# Altium project Grandmaster.PrjPcb
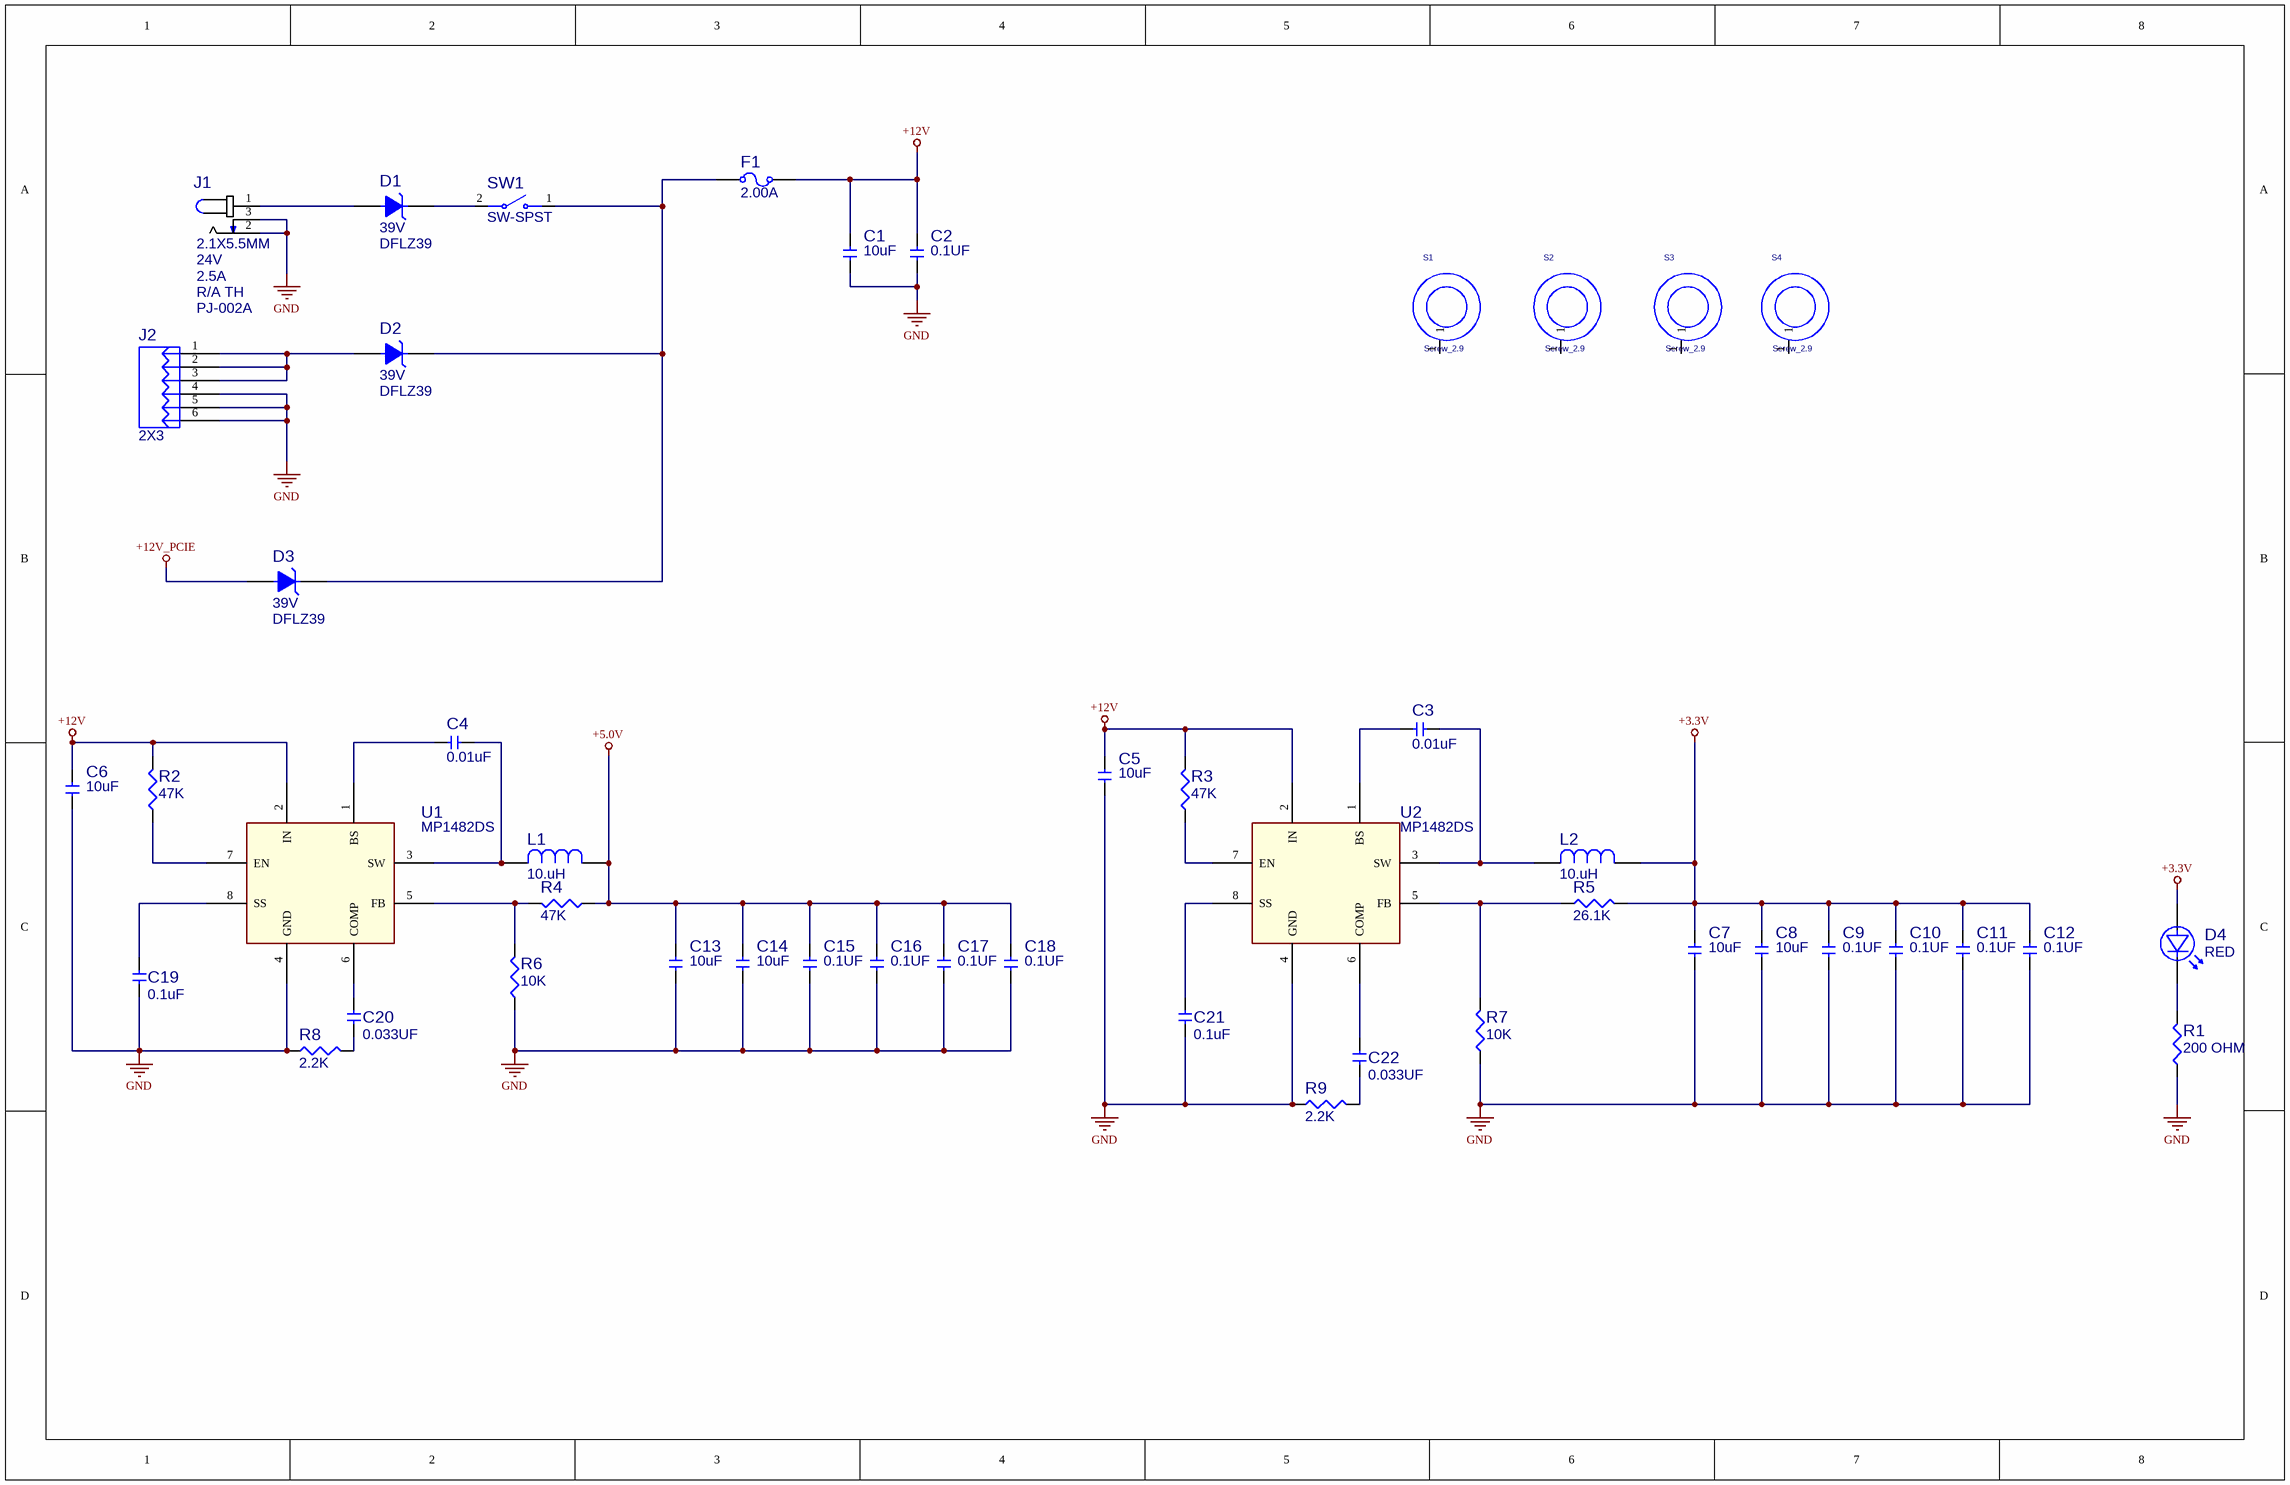
[diagram p0: Power Supplies.SchDoc]
3 sheets, 76 parts. Net scope: global (net labels, ports and power ports of the same name join across sheets).
Board file: Grandmaster.PcbDoc
Sheets:
  Power Supplies.SchDoc
  GPS-IMU.SchDoc
  FPGA.SchDoc

## Sheet Power Supplies.SchDoc: Grandmaster Power Supplies
size Tabloid; Author: N Smith; Revision: A; SheetNumber: 1; SheetTotal: 6; Customer: 01910

### Parts
C1  value 10uF  [CAPC2012X14N]  (hidden comment: CAP_0805_10UF_25V)
C2  value 0.1UF  [CAPC1005X06N]  (hidden comment: CAP_0402_0.1UF_50V)
C3  value 0.01uF  [CAPC1608X10N]  (hidden comment: CAP_0603_0.01UF_50V)
C4  value 0.01uF  [CAPC1608X10N]  (hidden comment: CAP_0603_0.01UF_50V)
C5  value 10uF  [CAPC2012X14N]  (hidden comment: CAP_0805_10UF_25V)
C6  value 10uF  [CAPC2012X14N]  (hidden comment: CAP_0805_10UF_25V)
C7  value 10uF  [CAPC2012X14N]  (hidden comment: CAP_0805_10UF_25V)
C8  value 10uF  [CAPC2012X14N]  (hidden comment: CAP_0805_10UF_25V)
C9  value 0.1UF  [CAPC1005X06N]  (hidden comment: CAP_0402_0.1UF_50V)
C10  value 0.1UF  [CAPC1005X06N]  (hidden comment: CAP_0402_0.1UF_50V)
C11  value 0.1UF  [CAPC1005X06N]  (hidden comment: CAP_0402_0.1UF_50V)
C12  value 0.1UF  [CAPC1005X06N]  (hidden comment: CAP_0402_0.1UF_50V)
C13  value 10uF  [CAPC2012X14N]  (hidden comment: CAP_0805_10UF_25V)
C14  value 10uF  [CAPC2012X14N]  (hidden comment: CAP_0805_10UF_25V)
C15  value 0.1UF  [CAPC1005X06N]  (hidden comment: CAP_0402_0.1UF_50V)
C16  value 0.1UF  [CAPC1005X06N]  (hidden comment: CAP_0402_0.1UF_50V)
C17  value 0.1UF  [CAPC1005X06N]  (hidden comment: CAP_0402_0.1UF_50V)
C18  value 0.1UF  [CAPC1005X06N]  (hidden comment: CAP_0402_0.1UF_50V)
C19  value 0.1uF  [CAPC1608X10N]  (hidden comment: CAP_0603_0.1UF_50V)
C20  value 0.033UF  [CAPC1005X06N]  (hidden comment: CGA2B3X5R1H333K050BB)
C21  value 0.1uF  [CAPC1608X10N]  (hidden comment: CAP_0603_0.1UF_50V)
C22  value 0.033UF  [CAPC1005X06N]  (hidden comment: CGA2B3X5R1H333K050BB)
D1  value DFLZ39  P1: 39V  [SODFL370X135-2N]  (hidden comment: DFLZ39-TP)
D2  value DFLZ39  P1: 39V  [SODFL370X135-2N]  (hidden comment: DFLZ39-TP)
D3  value DFLZ39  P1: 39V  [SODFL370X135-2N]  (hidden comment: DFLZ39-TP)
D4  RED  [DIOM1608X06N]
F1  value 2.00A  [FUSM1608X60N]  (hidden comment: FUSE_0603_2.00A)
J1  P1: 2.1X5.5MM  P2: 24V  P3: 2.5A  SIZE: R/A TH  [CUI_PJ-002A]  (hidden comment: PJ-002A)
J2  value 2X3  [39-30-1060]  (hidden comment: 39-30-1060)
L1  value 10.uH  [IND_PM124SH]  (hidden comment: PM124SH-100M-RC)
L2  value 10.uH  [IND_PM124SH]  (hidden comment: PM124SH-100M-RC)
R1  value 200 OHM  [RESC1608X50N]  (hidden comment: ERJ-3EKF2000V)
R2  value 47K  [RESC1608X50N]  (hidden comment: ERJ-3EKF4702V)
R3  value 47K  [RESC1608X50N]  (hidden comment: ERJ-3EKF4702V)
R4  value 47K  [RESC1608X50N]  (hidden comment: ERJ-3EKF4702V)
R5  value 26.1K  [RESC1608X50N]  (hidden comment: ERJ-3EKF2612V)
R6  value 10K  [RESC1608X50N]  (hidden comment: ERJ-3EKF1002V)
R7  value 10K  [RESC1608X50N]  (hidden comment: ERJ-3EKF1002V)
R8  value 2.2K  [RESC1608X50N]  (hidden comment: ERJ-3EKF2201V)
R9  value 2.2K  [RESC1608X50N]  (hidden comment: ERJ-3EKF2201V)
S1  Screw_2.9  [MH_250H125]
S2  Screw_2.9  [MH_250H125]
S3  Screw_2.9  [MH_250H125]
S4  Screw_2.9  [MH_250H125]
SW1  value SW-SPST  [L101011MS02Q]  (hidden comment: L101011MS02Q)
U1  value MP1482DS  [SOIC127P600X175-8N]  (hidden comment: MP1482DS-LF)
U2  value MP1482DS  [SOIC127P600X175-8N]  (hidden comment: MP1482DS-LF)

### Nets
+3.3V: C7.1 C8.1 C9.1 C10.1 C11.1 C12.1 D4.2(A) L2.1 R5.2
+5.0V: C13.1 C14.1 C15.1 C16.1 C17.1 C18.1 L1.1 R4.1
+12V: C1.1 C2.1 C5.1 C6.1 F1.2 R2.2 R3.2 U1.2(IN) U2.2(IN)
+12V_PCIE: D3.2(A)
GND: C1.2 C2.2 C5.2 C6.2 C7.2 C8.2 C9.2 C10.2 C11.2 C12.2 C13.2 C14.2 C15.2 C16.2 C17.2 C18.2 C19.1 C21.1 J1.2 J1.3 J2.4 J2.5 J2.6 R1.1 R6.1 R7.1 R8.1 R9.1 U1.4(GND) U2.4(GND)
NetC3_1: C3.1 U2.1(BS)
NetC3_2: C3.2 L2.2 U2.3(SW)
NetC4_1: C4.1 U1.1(BS)
NetC4_2: C4.2 L1.2 U1.3(SW)
NetC19_2: C19.2 U1.8(SS)
NetC20_1: C20.1 U1.6(COMP)
NetC20_2: C20.2 R8.2
NetC21_2: C21.2 U2.8(SS)
NetC22_1: C22.1 U2.6(COMP)
NetC22_2: C22.2 R9.2
NetD1_1: D1.1(C) SW1.2
NetD1_2: D1.2(A) J1.1
NetD2_1: D2.1(C) D3.1(C) F1.1 SW1.1
NetD2_2: D2.2(A) J2.1 J2.2 J2.3
NetD4_1: D4.1(K) R1.2
NetR2_1: R2.1 U1.7(EN)
NetR3_1: R3.1 U2.7(EN)
NetR4_2: R4.2 R6.2 U1.5(FB)
NetR5_1: R5.1 R7.2 U2.5(FB)

Not connected (* = marked no-connect by the designer): S1 1; S2 1; S3 1; S4 1

### Library data of the parts
C1 C5-C8 C13 C14 = CAP_0805_10UF_25V: CAP, CER, 10.UF, 25V, 10%, X5R, 0805; MFG PART NUM: TMK212BBJ106KG-T; VALENTIUM PART NUM: <VALENTIUM>; MFG NAME: TAIYO YUDEN; MAXTEMP: 85C; MINTEMP: -55C; DESC: CAP, CER, 10.UF, 10V, 10%, X5R, 0805; MODIFY DATE: 10/23/2013; CATEGORY: CAP, CER; Date: 4/11/2006 3:37:28 PM; SHEETPART: *; P1: 10%; P2: 25V; P3: X5R; Size: 0805; Supplier 1: MOUSER; Supplier Part Number 1: 963-TMK212BBJ106KG-T
C2 C9-C12 C15-C18 = CAP_0402_0.1UF_50V: CAP, CER, 0.1UF, 50V, 10%, X7R, AEC-Q200, 0402; MFG PART NUM: CGA2B3X7R1H104K050BB; VALENTIUM PART NUM: <VALENTIUM>; MFG NAME: TDK; MAXTEMP: 125C; MINTEMP: -55C; CATEGORY: CAP, CER; MODIFY DATE: 10/23/2013; SHEETPART: *; P1: 10%; OTHER: AEC-Q200; P2: 50V; P3: X7R; Size: 0402; DESC: CAP, CER, 0.1UF, 50V, 10%, X7R, AEC-Q200, 0402; Supplier 1: Digi-Key; Supplier Part Number 1: 445-6899-1-ND
C3 C4 = CAP_0603_0.01UF_50V: CAP, CER, 0.01UF, 50V, 10%, X7R, 0603; MFG PART NUM: C0603C103K5RACTU; VALENTIUM PART NUM: <VALENTIUM>; MFG NAME: KEMET; MAXTEMP: 125C; MINTEMP: -55C; CATEGORY: CAP, CER; MODIFY DATE: 10/23/2013; Date: 7/24/2013; SHEETPART: *; P1: 10%; P2: 50V; P3: X7R; Size: 0603; Supplier 1: Digi-Key; Supplier Part Number 1: 399-1091-1-ND; DESC: CAP, CER, 0.01UF, 50V, 10%, X7R, 0603
C19 C21 = CAP_0603_0.1UF_50V: CAP, CER, 0.1UF, 50V, 10%, X7R, 0603; MFG PART NUM: C0603C104K5RACTU; VALENTIUM PART NUM: <VALENTIUM>; MFG NAME: KEMET; MAXTEMP: 125C; MINTEMP: -55C; CATEGORY: CAP, CER; MODIFY DATE: 10/23/2013; Date: 7/24/2013; SHEETPART: *; P1: 10%; P2: 50V; P3: X7R; Size: 0603; Supplier 1: Digi-Key; Supplier Part Number 1: 399-5089-1-ND; DESC: CAP, CER, 0.1UF, 50V, 10%, X7R, 0603
C20 C22 = CAP_0402_0.033UF_50V: CAP, CER, 0.033UF, 50V, 10%, X7R, AEC-Q200, 0402; VALENTIUM PART NUM: <VALENTIUM>; MFG NAME: TDK; MAXTEMP: 85C; MINTEMP: -55C; CATEGORY: CAP, CER; MFG PART NUM: CGA2B3X5R1H333K050BB; MODIFY DATE: 10/23/2013; SHEETPART: *; P1: 10%; OTHER: AEC-Q200; P2: 50V; P3: X7R; Size: 0402; DESC: CAP, CER, 0.033UF, 50V, 10%, X7R, AEC-Q200, 0402; Supplier 1: Digi-Key; Supplier Part Number 1: 445-12207-1-ND
D1-D3 = DFLZ39: DIO, ZENER, DFLZ39, 39V, 5%, 1W, SOD123FL; VALENTIUM PART NUM: <VALENTIUM>; MFG NAME: MICRO COMM; MAXTEMP: 150C; MINTEMP: -55C; OTHER: SERIES; MFG PART NUM: DFLZ39-TP; MODIFY DATE: 9/4/2013; CATEGORY: DIO, ZENER; P2: 5%; P3: 1W; SIZE: SOD123FL; SHEETPART: *; DESC: DIO, ZENER, DFLZ39, 39V, 5%, 1W, SOD123FL; Supplier 1: Digi-Key; Supplier Part Number 1: DFLZ39-TPMSDKR-ND
D4 = SMTLED_RED_0603_SML: LED, RED, SML-LX0603, 635NM, 2V, 20MA, 0603; MFG PART NUM: SML-LX0603IW-TR; VALENTIUM PART NUM: <VALENTIUM>; MFG NAME: LUMEX; MAXTEMP: 85C; MINTEMP: -25C; MODIFY DATE: 9/4/2013; CATEGORY: LED; OTHER: SML-LX0603; P1: 635NM; P2: 2V; P3: 20MA; SIZE: 0603; SHEETPART: *; DESC: LED, RED, SML-LX0603, 635NM, 2V, 20MA, 0603; Supplier 1: Digi-Key; Supplier Part Number 1: 67-1548-1-ND; VALUE: RED
F1 = FUSE_0603_2.00A: FUSE SLOW 2.00A 32V M 0603; MFG PART NUM: SF-0603S200-2; VALENTIUM PART NUM: <VALENTIUM>; MFG NAME: BOURNS; MAXTEMP: 105C; MINTEMP: -40C; OTHER: UL E141069; P1: SLOW BLO; DESC: FUSE SLOW 1.25A 32V M 0603; MODIFY DATE: 9/4/2013; CATEGORY: FUSE; DATE: 20 OCT 15; P2: 32V; P3: M; SIZE: 0603; SHEETPART: *; Supplier 1: Digi-Key; Supplier Part Number 1: SF-0603S200-2CT-ND
J1 = PJ-002A: CONN, JACK, PJ-002A, 2.1X5.5MM, 24V 2.5A, R/A TH, SPST-NC; VALENTIUM PART NUM: <VALENTIUM>; MAXTEMP: 85C; MFG NAME: CUI DEVICES; MINTEMP: -25C; CATEGORY: CONN, JACK; DESC: CONN, JACK, PJ-002A, 2.1X5.5MM, 24V 2.5A, R/A TH, SPST-NC; MFG PART NUM: PJ-002A; OTHER: SPST-NC; Supplier 1: Digi-Key; Supplier Part Number 1: CP-002A-ND; Value: PJ-002A
J2 = 39-30-1060: CONN, HDR, 2X3, R/A, 4.2MM, TH, MINI-FIT JR; MFG PART NUM: 105314-1206; VALENTIUM PART NUM: <VALENTIUM>; MFG NAME: MOLEX; MAXTEMP: 105C; MINTEMP: -40C; OTHER: NANO-FIT; P2: 2.5MM; DESC: CONN, HDR, 2X3, R/A, 2.5MM, TH, NANO-FIT; MODIFY DATE: 10/10/2013; CATEGORY: CONN, HDR; P1: R/A; SIZE: TH; Supplier 1: Digi-Key; Supplier Part Number 1: WM14977-ND
L1 L2 = PM124SH-100M-RC: IND, PWR, 10.uH, 20%, 4A, 0.04DCR, 12.5X12.5MM, SHLD; VALENTIUM PART NUM: <VALENTIUM>; MFG NAME: BOURNS; MAXTEMP: 125C; MINTEMP: -40C; P3: 36mOhm; MFG PART NUM: PM124SH-100M-RC; MODIFY DATE: 10/23/2013; Date: 10/23/2013; CATEGORY: IND, PWR; OTHER: SHLD; P1: 20%; P2: 4A; SIZE: 12.5X12.5MM; SHEETPART: *; DESC: IND, PWR, 10.uH, 20%, 4A, 0.04DCR, 12.5X12.5MM, SHLD; Supplier 1: Digi-Key; Supplier Part Number 1: PM124SH-100M-RCCT-ND
R1 = RES_0603_200: RES, 200 OHM, 1%, 1/10W, TF, 0603; VELENTIUM PART NUM: <VELENTIUM>; MFG NAME: PANASONIC; MAXTEMP: 125C; MINTEMP: -55C; OTHER: 100PPM; SUB: GENERIC; ModifyDate: 7/25/2013; MFG PART NUM: ERJ-3EKF2000V; CATEGORY: RES; Date: 7/26/2013; P1: 1%; P3: TF; P2: 1/10W; SIZE: 0603; SHEETPART: *; DESC: RES, 200 OHM, 1%, 1/10W, TF, 0603; Supplier 1: Digi-Key; Supplier Part Number 1: P200HCT-ND
R2-R4 = RES_0603_47K: RES, 47K, 1%, 1/10W, TF, 0603; VELENTIUM PART NUM: <VELENTIUM>; MFG NAME: PANASONIC; MAXTEMP: 125C; MINTEMP: -55C; OTHER: 100PPM; SUB: GENERIC; ModifyDate: 1/22/2014; MFG PART NUM: ERJ-3EKF4702V; CATEGORY: RES; Date: 1/22/2014; P1: 1%; P3: TF; P2: 1/10W; SIZE: 0603; SHEETPART: *; DESC: RES, 47K, 1%, 1/10W, TF, 0603; Supplier 1: Digi-Key; Supplier Part Number 1: P47.0KHCT-ND
R5 = RES_0603_26.1K: RES, 26.1K, 1%, 1/10W, TF, 0603; VELENTIUM PART NUM: <VELENTIUM>; MFG NAME: PANASONIC; MAXTEMP: 125C; MINTEMP: -55C; OTHER: 100PPM; SUB: GENERIC; DESC: RES, 27.1K, 1%, 1/10W, TF, 0603; ModifyDate: 7/25/2013; MFG PART NUM: ERJ-3EKF2612V; CATEGORY: RES; Date: 7/26/2013; P1: 1%; P3: TF; P2: 1/10W; SIZE: 0603; SHEETPART: *; Supplier 1: Digi-Key; Supplier Part Number 1: P26.1KHCT-ND
R6 R7 = RES_0603_10K: RES, 10K, 1%, 1/10W, TF, 0603; VELENTIUM PART NUM: <VELENTIUM>; MFG NAME: PANASONIC; MAXTEMP: 125C; MINTEMP: -55C; OTHER: 100PPM; SUB: GENERIC; ModifyDate: 7/25/2013; MFG PART NUM: ERJ-3EKF1002V; CATEGORY: RES; Date: 7/26/2013; P1: 1%; P3: TF; P2: 1/10W; SIZE: 0603; Supplier 1: Digi-Key; Supplier Part Number 1: P10.0KHCT-ND; SHEETPART: *; DESC: RES, 10K, 1%, 1/10W, TF, 0603
R8 R9 = RES_0603_2.2K: RES, 2.2K, 1%, 1/10W, TF, 0603; VELENTIUM PART NUM: <VELENTIUM>; MFG NAME: PANASONIC; MAXTEMP: 125C; MINTEMP: -55C; OTHER: 100PPM; SUB: GENERIC; ModifyDate: 8/15/2013; MFG PART NUM: ERJ-3EKF2201V; CATEGORY: RES; Date: 8/15/2013; P1: 1%; P3: TF; P2: 1/10W; SIZE: 0603; Supplier 1: Digi-Key; Supplier Part Number 1: P2.20KHCT-ND; SHEETPART: *; DESC: RES, 2.2K, 1%, 1/10W, TF, 0603
S1-S4 = screw_0: FH140 Screw,Diameter 2.9mm; Part Number: 454; Manufacturer: NA; Vendor P/N: NA; Part Type: SMT
SW1 = L101011MS02Q: SW, SPST, 250V, 2A, SLIDE, ON-OFF, TH; VALENTIUM PART NUM: <VALENTIUM>; MFG NAME: C&K; MAXTEMP: 85C; MINTEMP: -25C; MFG PART NUM: L101011MS02Q; MODIFY DATE: 1/21/2014; CATEGORY: SW; DATE: 9/5/2013; OTHER: L101011MS02Q; P1: 250V; P2: 2A; P3: SW, SPST, 250V, 2A, SLIDE, ON-OFF, TH; SIZE: 19.1X10.79MM; SHEETPART: *; DESC: SW, SPST, 250V, 2A, SLIDE, ON-OFF, TH; Supplier 1: Digi-Key; Supplier Part Number 1: CKC5106-ND
U1 U2 = MP1482DS: IC, DC/DC, MP1482DS, >4.75VIN, 0.923-15V OUT, SOIC8; VELENTIUM PART NUM: <V PART NUM>; MFG NAME: MPS; MAXTEMP: +85C; MINTEMP: -40C; OTHER: additional spec; P3: W; MFG PART NUM: MP1482DS-LF; MODIFY DATE: 12/27/2005 8:34:25 AM; CATEGORY: IC, DC/DC; P1: >4.75V IN; P2: 0.923-15V OUT; SIZE: 8SOIC; SHEETPART: *; DESC: IC, DC/DC, MP1482DS, >4.75VIN, 0.923-15V OUT, SOIC8; Supplier 1: Digi-Key; Supplier Part Number 1: 1589-1524-1-ND

## Sheet GPS-IMU.SchDoc: Gransmaster GPS & IMU
size Tabloid; Author: N Smith; Revision: A; SheetNumber: 4; SheetTotal: 6; Customer: 01910
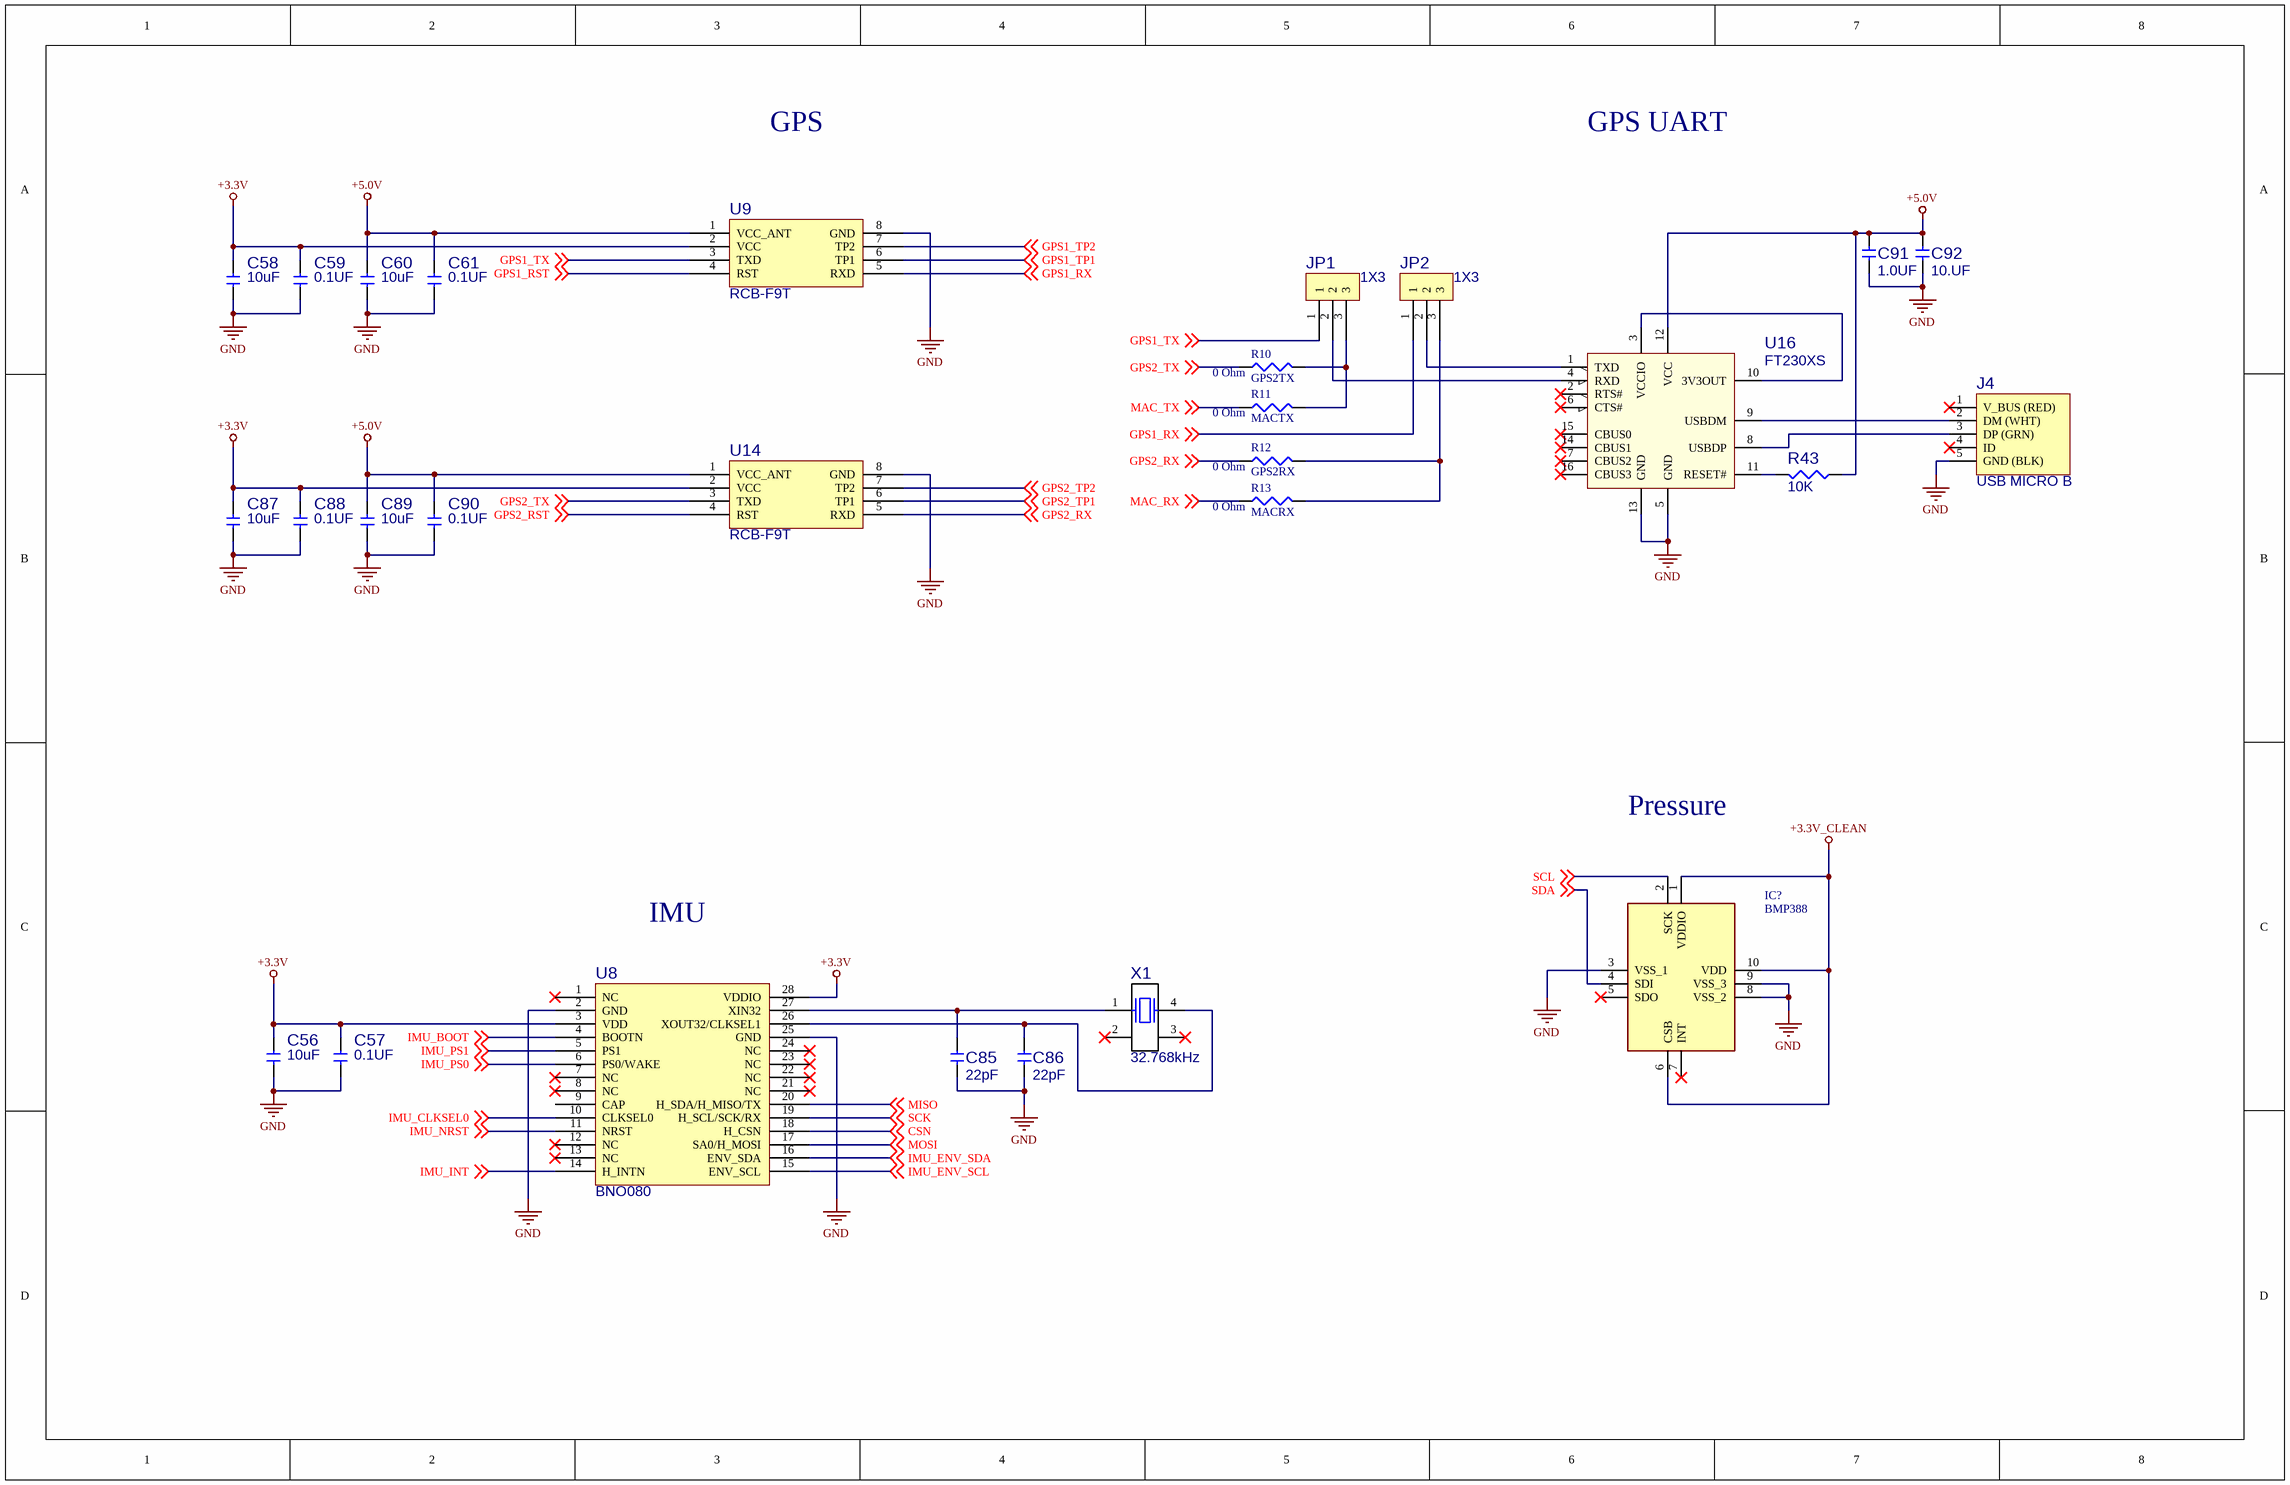
[diagram p1: GPS-IMU.SchDoc]

### Parts
C56  value 10uF  [CAPC2012X14N]  (hidden comment: CAP_0805_10UF_25V)
C57  value 0.1UF  [CAPC1005X06N]  (hidden comment: CAP_0402_0.1UF_50V)
C58  value 10uF  [CAPC2012X14N]  (hidden comment: CAP_0805_10UF_25V)
C59  value 0.1UF  [CAPC1005X06N]  (hidden comment: CAP_0402_0.1UF_50V)
C60  value 10uF  [CAPC2012X14N]  (hidden comment: CAP_0805_10UF_25V)
C61  value 0.1UF  [CAPC1005X06N]  (hidden comment: CAP_0402_0.1UF_50V)
C85  value 22pF  [CAPC1608X10N]  (hidden comment: CAP_0603_22PF_50V)
C86  value 22pF  [CAPC1608X10N]  (hidden comment: CAP_0603_22PF_50V)
C87  value 10uF  [CAPC2012X14N]  (hidden comment: CAP_0805_10UF_25V)
C88  value 0.1UF  [CAPC1005X06N]  (hidden comment: CAP_0402_0.1UF_50V)
C89  value 10uF  [CAPC2012X14N]  (hidden comment: CAP_0805_10UF_25V)
C90  value 0.1UF  [CAPC1005X06N]  (hidden comment: CAP_0402_0.1UF_50V)
C91  value 1.0UF  [CAPC2012X14N]  (hidden comment: CAP_0805_1UF_25V)
C92  value 10.UF  [CAPC1608X10N]  (hidden comment: GRT188R61E106ME13D)
IC?  BMP388  [BMP388]
J4  value USB MICRO B  [USB_47346-1001]  (hidden comment: 473461001)
JP1  value 1X3  [3PINV-100]  (hidden comment: JUMPER_3PIN)
JP2  value 1X3  [3PINV-100]  (hidden comment: JUMPER_3PIN)
R10  GPS2TX  value 0 Ohm  [J1-0603]
R11  MACTX  value 0 Ohm  [J1-0603]
R12  GPS2RX  value 0 Ohm  [J1-0603]
R13  MACRX  value 0 Ohm  [J1-0603]
R43  value 10K  [RESC1608X50N]  (hidden comment: ERJ-3EKF1002V)
U8  BNO080  [LGA-28]
U9  RCB-F9T  [RCB-F9T]
U14  RCB-F9T  [RCB-F9T]
U16  value FT230XS  [SOP64P600X170-16N]  (hidden comment: FT230XS-R)
X1  value 32.768kHz  [SM8]  (hidden comment: MC306)

### Nets
+3.3V: C56.1 C57.1 C58.1 C59.1 C87.1 C88.1 U8.3(VDD) U8.28(VDDIO) U9.2(VCC) U14.2(VCC)
+3.3V_CLEAN: IC?.1(VDDIO) IC?.6(CSB) IC?.10(VDD)
+5.0V: C60.1 C61.1 C89.1 C90.1 C91.2 C92.2 R43.1 U9.1(VCC_ANT) U14.1(VCC_ANT) U16.12(VCC)
GND: C56.2 C57.2 C58.2 C59.2 C60.2 C61.2 C85.1 C86.1 C87.2 C88.2 C89.2 C90.2 C91.1 C92.1 IC?.3(VSS_1) IC?.8(VSS_2) IC?.9(VSS_3) J4.5(GND_(BLK)) U8.2(GND) U8.25(GND) U9.8(GND) U14.8(GND) U16.5(GND) U16.13(GND)
CSN: U8.18(H_CSN) ; off-sheet CSN
GPS1_RST: U9.4(RST) ; off-sheet GPS1_RST
GPS1_RX: JP2.1 U9.5(RXD) ; off-sheet GPS1_RX
GPS1_TP1: U9.6(TP1) ; off-sheet GPS1_TP1
GPS1_TP2: U9.7(TP2) ; off-sheet GPS1_TP2
GPS1_TX: JP1.1 U9.3(TXD) ; off-sheet GPS1_TX
GPS2_RST: U14.4(RST) ; off-sheet GPS2_RST
GPS2_RX: R12.1 U14.5(RXD) ; off-sheet GPS2_RX
GPS2_TP1: U14.6(TP1) ; off-sheet GPS2_TP1
GPS2_TP2: U14.7(TP2) ; off-sheet GPS2_TP2
GPS2_TX: R10.1 U14.3(TXD) ; off-sheet GPS2_TX
IMU_BOOT: U8.4(BOOTN) ; off-sheet IMU_BOOT
IMU_CLKSEL0: U8.10(CLKSEL0) ; off-sheet IMU_CLKSEL0
IMU_ENV_SCL: U8.15(ENV_SCL) ; off-sheet IMU_ENV_SCL
IMU_ENV_SDA: U8.16(ENV_SDA) ; off-sheet IMU_ENV_SDA
IMU_INT: U8.14(H_INTN) ; off-sheet IMU_INT
IMU_NRST: U8.11(NRST) ; off-sheet IMU_NRST
IMU_PS0: U8.6(PS0/WAKE) ; off-sheet IMU_PS0
IMU_PS1: U8.5(PS1) ; off-sheet IMU_PS1
MAC_RX: R13.1 ; off-sheet MAC_RX
MAC_TX: R11.1 ; off-sheet MAC_TX
MISO: U8.20(H_SDA/H_MISO/TX) ; off-sheet MISO
MOSI: U8.17(SA0/H_MOSI) ; off-sheet MOSI
SCK: U8.19(H_SCL/SCK/RX) ; off-sheet SCK
SCL: IC?.2(SCK) ; off-sheet SCL
SDA: IC?.4(SDI) ; off-sheet SDA
NetC85_2: C85.2 U8.27(XIN32) X1.1
NetC86_2: C86.2 U8.26(XOUT32/CLKSEL1) X1.4
NetJ4_2: J4.2(DM_(WHT)) U16.9(USBDM)
NetJ4_3: J4.3(DP_(GRN)) U16.8(USBDP)
NetJP1_2: JP1.2 U16.4(RXD)
NetJP1_3: JP1.3 R10.2 R11.2
NetJP2_2: JP2.2 U16.1(TXD)
NetJP2_3: JP2.3 R12.2 R13.2
NetR43_2: R43.2 U16.11(RESET#)
NetU16_3: U16.3(VCCIO) U16.10(3V3OUT)

Not connected (* = marked no-connect by the designer): IC? 5(SDO)* 7(INT)*; J4 1(V_BUS_(RED))* 4(ID)*; U8 1(NC)* 7(NC)* 8(NC)* 9(CAP) 12(NC)* 13(NC)* 21(NC)* 22(NC)* 23(NC)* 24(NC)*; U16 2(RTS#)* 6(CTS#)* 7(CBUS2)* 14(CBUS1)* 15(CBUS0)* 16(CBUS3)*; X1 2* 3*

### Notes on the sheet
- GPS
- GPS UART
- Pressure
- IMU

### Library data of the parts
C56 C58 C60 C87 C89 = CAP_0805_10UF_25V: as C1 on sheet Power Supplies; MODIFY DATE: 10/23/2013; CATEGORY: CAP, CER; Date: 4/11/2006 3:37:28 PM; SHEETPART: *; P1: 10%; P2: 25V; P3: X5R; Size: 0805; Supplier 1: MOUSER; Supplier Part Number 1: 963-TMK212BBJ106KG-T
C57 C59 C61 C88 C90 = CAP_0402_0.1UF_50V: as C2 on sheet Power Supplies; CATEGORY: CAP, CER; MODIFY DATE: 10/23/2013; SHEETPART: *; P1: 10%; OTHER: AEC-Q200; P2: 50V; P3: X7R; Size: 0402; DESC: CAP, CER, 0.1UF, 50V, 10%, X7R, AEC-Q200, 0402; Supplier 1: Digi-Key; Supplier Part Number 1: 445-6899-1-ND
C85 C86 = CAP_0603_22PF_50V: CAP, CER, 22.PF, 50V, 5%, NPO, 0603; MFG PART NUM: C0603C220J5GACTU; VALENTIUM PART NUM: <VALENTIUM>; MFG NAME: KEMET; MAXTEMP: 125C; MINTEMP: -55C; P3: NP0; CATEGORY: CAP, CER; MODIFY DATE: 10/23/2013; Date: 7/25/2013; SHEETPART: *; P1: 5%; P2: 50V; Size: 0603; Supplier 1: Digi-Key; Supplier Part Number 1: 399-1053-1-ND; DESC: CAP, CER, 22.PF, 50V, 5%, NPO, 0603
C91 = CAP_0805_1UF_25V: CAP, CER, 1.0UF, 25V, 10%, X5R, 0805; MFG PART NUM: 08053D105KAT2A; VALENTIUM PART NUM: <VALENTIUM>; MFG NAME: AVX; MAXTEMP: 85C; MINTEMP: -55C; MODIFY DATE: 10/23/2013; CATEGORY: CAP, CER; Date: 4/11/2006 3:37:28 PM; SHEETPART: *; P1: 10%; P2: 25V; P3: X5R; Size: 0805; Supplier 1: Digi-Key; Supplier Part Number 1: 478-1409-1-ND; DESC: CAP, CER, 1.0UF, 25V, 10%, X5R, 0805
C92 = CAP_0603_10UF_25V: CAP, CER, 10.UF, 25V, 20%, X5R, AEC-Q200, 0603; VALENTIUM PART NUM: <VALENTIUM>; MFG NAME: MURATA; MAXTEMP: 85C; MINTEMP: -55C; CATEGORY: CAP, CER; MFG PART NUM: GRT188R61E106ME13D; MODIFY DATE: 10/23/2013; Date: 7/25/2013; SHEETPART: *; P1: 20%; OTHER: AEC-Q200; P2: 25V; P3: X5R; Size: 0603; DESC: CAP, CER, 10.UF, 25V, 20%, X5R, AEC-Q200, 0603; Supplier 1: Digi-Key; Supplier Part Number 1: 490-12323-6-ND
IC? = BMP388: Integrated Circuit; Manufacturer_Name: Bosch Sensortec; Datasheet Link: https://ae-bst.resource.bosch.com/media/_tech/media/datasheets/BST-BMP388-DS001-01.pdf; Height: 0mm; Manufacturer_Part_Number: BMP388; Arrow Part Number: BMP388; Arrow Price/Stock: https://www.arrow.com/en/products/bmp388/bosch; Mouser Part Number: 262-BMP388; Mouser Price/Stock: https://www.mouser.co.uk/ProductDetail/Bosch-Sensortec/BMP388?qs=rrS6PyfT74eIcD5Rv1Kf7A%3D%3D
J4 = USB_B_473461001: CONN, REC, USB, R/A, MICRO, TYPE B, 5 POS, SMT FLANGELESS; VALENTIUM PART NUM: <VALENTIUM>; MFG NAME: MOLEX; MAXTEMP: 85C; MINTEMP: -30C; P2: 5 POS; CATEGORY: CONN, REC; MODIFY DATE: 10/10/2013; OTHER: FLANGELESS; P1: R/A; P3: USB MICRO B; SIZE: SMT; MFG PART NUM: 473461001; DESC: CONN, REC, USB, R/A, MICRO, TYPE B, 5 POS, SMT FLANGELESS; Supplier 1: Digi-Key; Supplier Part Number 1: WM11228CT-ND
JP1 JP2 = JUMPER_3PIN: CONN, HDR, 1X3, VERT, .1, JUMPER, TH; MFG PART NUM: TSW-103-08-G-S; VALENTIUM PART NUM: <VALENTIUM>; MFG NAME: SAMTEC; MAXTEMP: C; OTHER: TSW-1XX; P2: .1; P3: FEATURE; CATEGORY: CONN, HDR; MODIFY DATE: 10/10/2013; MINTEMP: C; P1: VERT; SIZE: TH; Supplier 1: Digi-Key; Supplier Part Number 1: SAM1038-02-ND; DESC: CONN, HDR, 1X3, VERT, .1, JUMPER, TH
R10-R13 = Res3: Resistor; Published: 8-Jun-2000; LatestRevisionDate: 29-May-2009; LatestRevisionNote: IPC-7351 Footprint Added.; PackageReference: J1-0603; Publisher: Altium Limited; PackageDescription: Chip Resistor
R43 = RES_0603_10K: as R6 on sheet Power Supplies; ModifyDate: 7/25/2013; MFG PART NUM: ERJ-3EKF1002V; CATEGORY: RES; Date: 7/26/2013; P1: 1%; P3: TF; P2: 1/10W; SIZE: 0603; Supplier 1: Digi-Key; Supplier Part Number 1: P10.0KHCT-ND; SHEETPART: *; DESC: RES, 10K, 1%, 1/10W, TF, 0603
U8 = BNO080: MOD, IMU, 5.2X3.8, SMT; VELENTIUM PART NUM: <V PART NUM>; MFG NAME: HILLCREST; MAXTEMP: +85C; MINTEMP: -40C; MFG PART NUM: BNO080; MODIFY DATE: 10/21/2013; CATEGORY: MOD; OTHER: IMU; SIZE: 5.2X3.8; SHEETPART: *; DESC: MOD, IMU, 5.2X3.8, SMT; Supplier 1: Digi-Key; Supplier Part Number 1: 1888-1000-1-ND; VALUE: BNO080
U9 U14 = RCB-F9T: MOD, GPS; VELENTIUM PART NUM: <V PART NUM>; MFG NAME: UBLOCKS; MINTEMP: -40C; MAXTEMP: 80C; DESC: MOD BLE 4.2; MFG PART NUM: RCB-F9T; CATEGORY: MOD; MODIFY DATE: 9/11/13; P1: GPS; SHEETPART: *; DATE: .; Supplier 1: Digi-Key; Supplier Part Number 1: 672-RCB-F9T-ND
U16 = FT230XS-R: IC, TCVR, FT230, USB TO UART, 5V, FTDI, 16SSOP; VELENTIUM PART NUM: <V PART NUM>; MAXTEMP: 85C; MINTEMP: -40C; MFG PART NUM: FT230XS-R; MFG NAME: FTDI; MODIFY DATE: 8/14/2013; CATEGORY: IC, TCVR; P1: USB TO UART; P2: 5V; P3: FTDI; SIZE: 20SSOP; SHEETPART: *; DESC: IC, TCVR, FT230, USB TO UART, 5V, FTDI, 16SSOP; Supplier 1: Digi-Key; Supplier Part Number 1: 768-1135-1-ND
X1 = MC306: XTAL, 32.768KHZ, 6PF LOAD CAP, SMD, ROHS; MFG PART NUM: MC-306 32.768K-E3:ROHS; VALENTIUM PART NUM: <VALENTIUM>; MFG NAME: ABRACON CORPORATION; MAXTEMP: 85C; MINTEMP: -40C; P2: 20PPM; P3: FUNDAMENTAL; OTHER: MC306, 3.8X8.00X2.54MM; DESC: XTAL, <VAL>, P1, P2, P3, EIA, OTHER; CATEGORY: XTAL; MODIFY DATE: 9/5/2013; P1: 6PF; Supplier 1: Digi-Key; Supplier Part Number 1: SER2417CT-ND; SIZE: 4-SOJ; SHEETPART: *

## Sheet FPGA.SchDoc: Grandmaster FPGA Connectors
size Tabloid; Author: N Smith; Revision: A; SheetNumber: 6; SheetTotal: 6; Customer: 01910
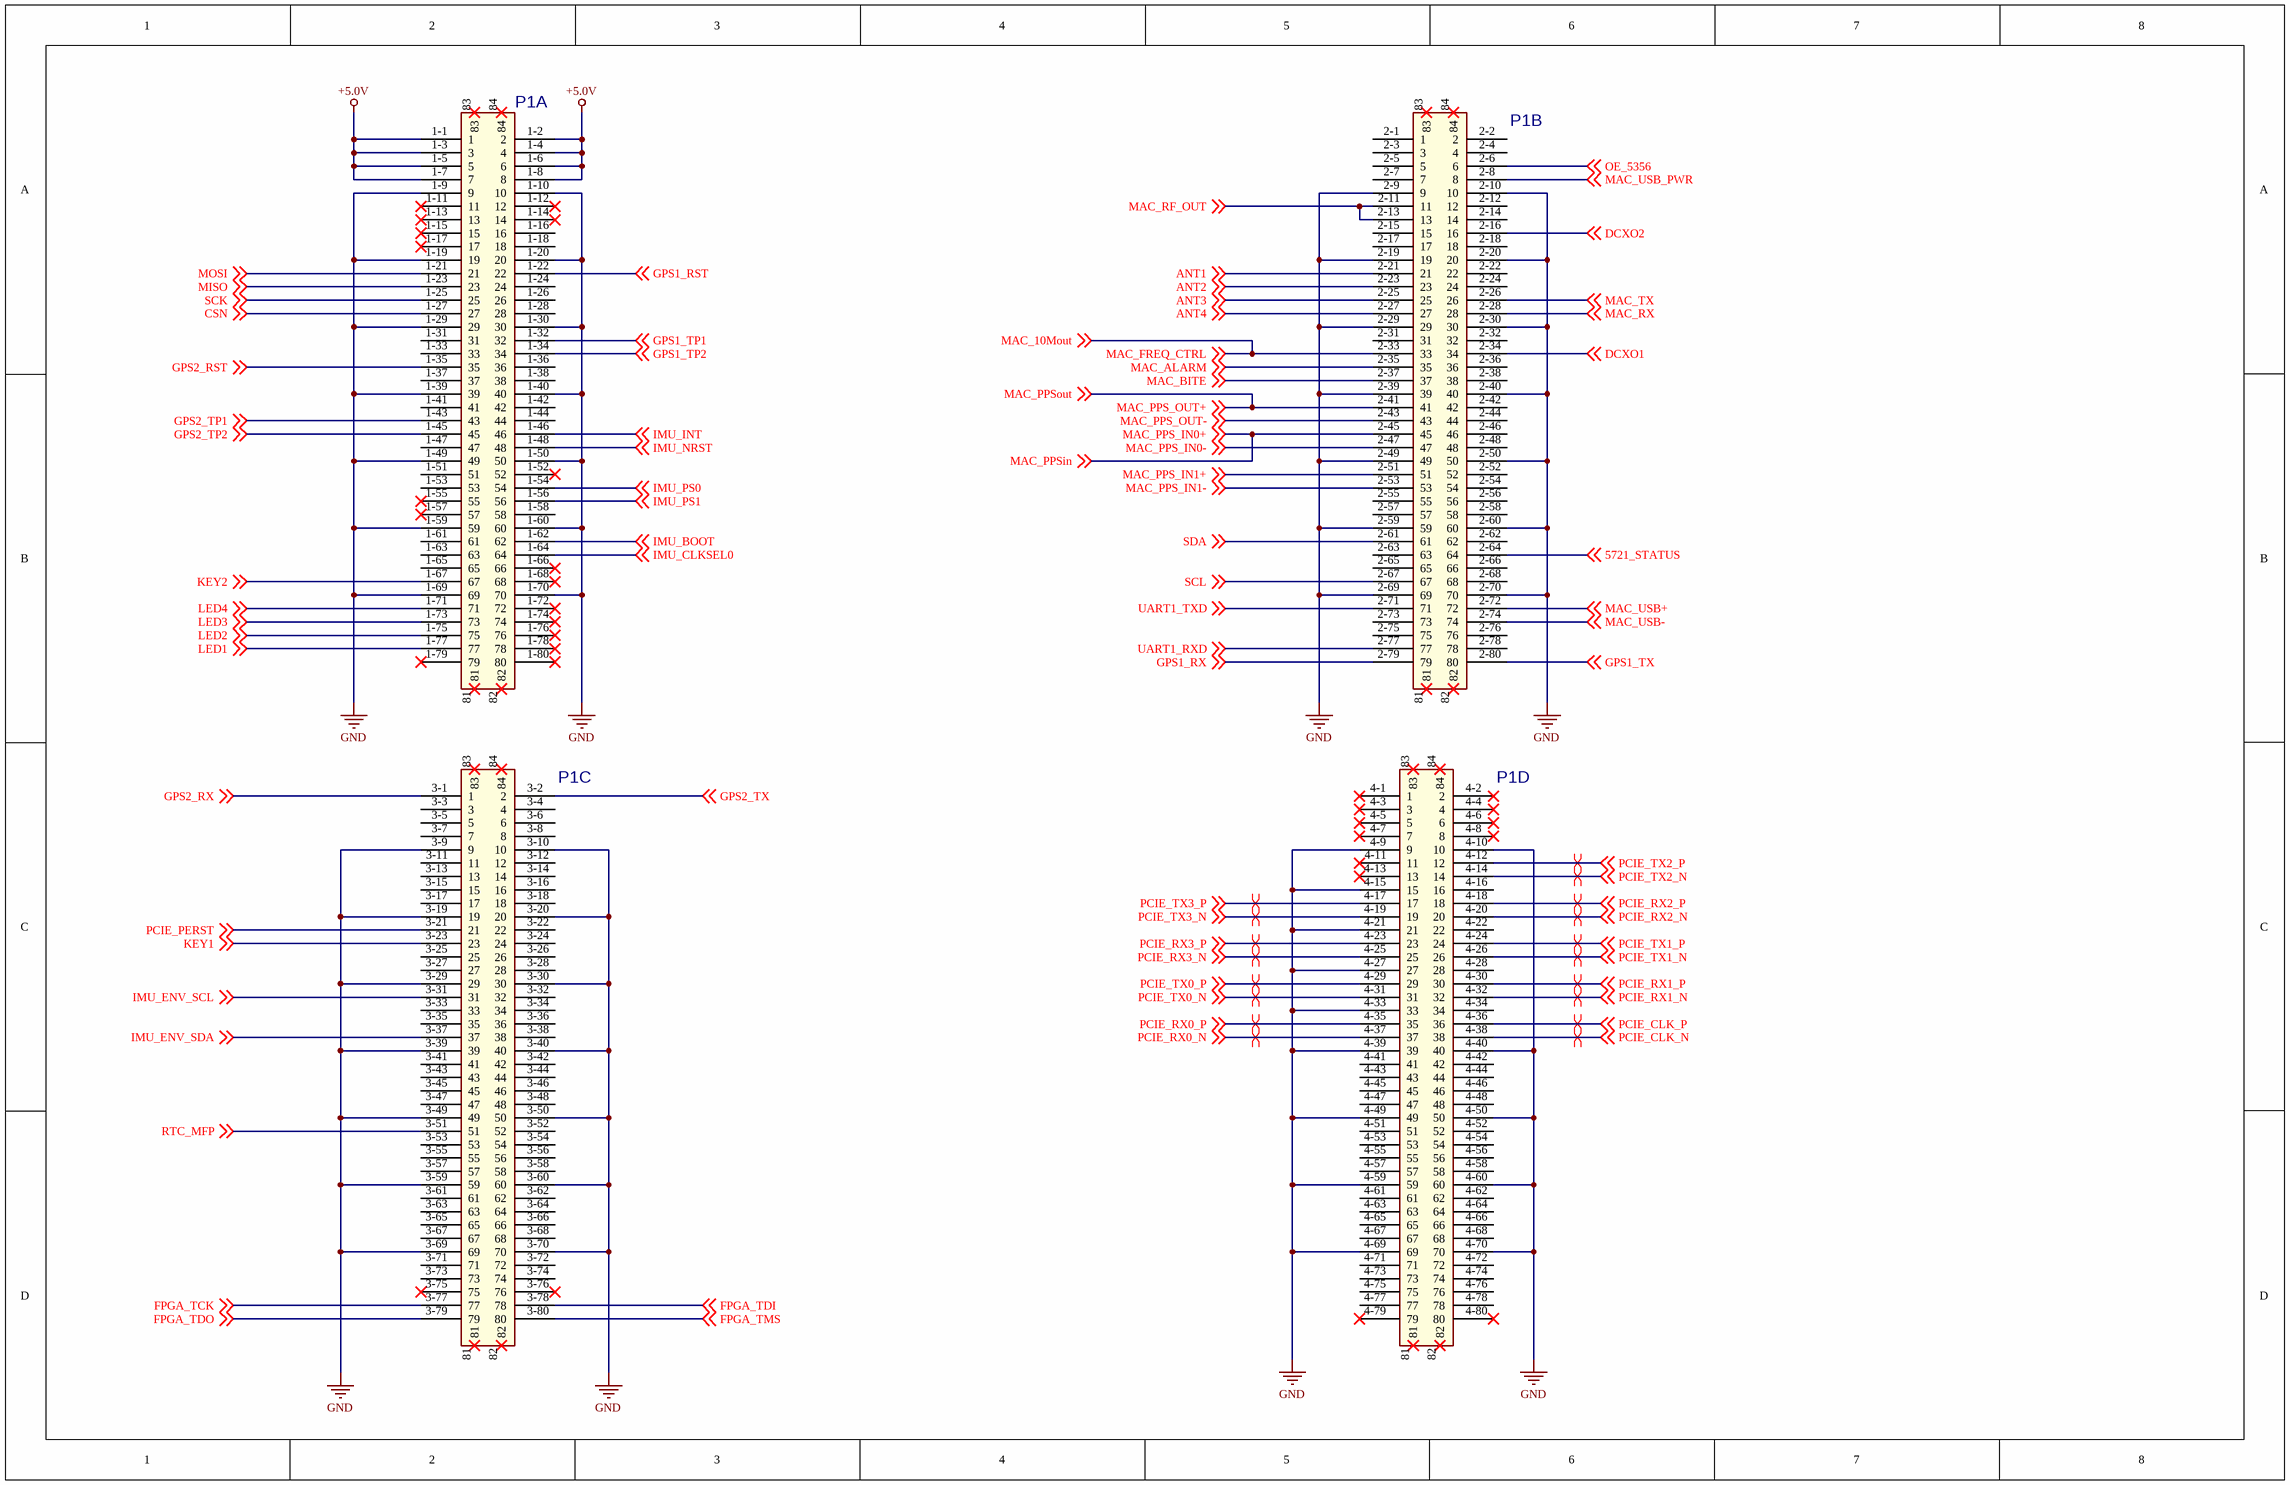
[diagram p2: FPGA.SchDoc]

### Parts
P1  MOD, FPGA, AC7100  [ALINX_FPGA]  (value not drawn)  (parts A,B,C,D of 4)

### Nets
+5.0V: P1.1-1(1) P1.1-2(2) P1.1-3(3) P1.1-4(4) P1.1-5(5) P1.1-6(6) P1.1-7(7) P1.1-8(8)
GND: P1.1-9(9) P1.1-10(10) P1.1-19(19) P1.1-20(20) P1.1-29(29) P1.1-30(30) P1.1-39(39) P1.1-40(40) P1.1-49(49) P1.1-50(50) P1.1-59(59) P1.1-60(60) P1.1-69(69) P1.1-70(70) P1.2-9(9) P1.2-10(10) P1.2-19(19) P1.2-20(20) P1.2-29(29) P1.2-30(30) P1.2-39(39) P1.2-40(40) P1.2-49(49) P1.2-50(50) P1.2-59(59) P1.2-60(60) P1.2-69(69) P1.2-70(70) P1.3-9(9) P1.3-10(10) P1.3-19(19) P1.3-20(20) P1.3-29(29) P1.3-30(30) P1.3-39(39) P1.3-40(40) P1.3-49(49) P1.3-50(50) P1.3-59(59) P1.3-60(60) P1.3-69(69) P1.3-70(70) P1.4-9(9) P1.4-10(10) P1.4-15(15) P1.4-21(21) P1.4-27(27) P1.4-33(33) P1.4-39(39) P1.4-40(40) P1.4-49(49) P1.4-50(50) P1.4-59(59) P1.4-60(60) P1.4-69(69) P1.4-70(70)
5721_STATUS: P1.2-64(64) ; off-sheet 5721_STATUS
ANT1: P1.2-21(21) ; off-sheet ANT1
ANT2: P1.2-23(23) ; off-sheet ANT2
ANT3: P1.2-25(25) ; off-sheet ANT3
ANT4: P1.2-27(27) ; off-sheet ANT4
CSN: P1.1-27(27) ; off-sheet CSN
DCXO1: P1.2-34(34) ; off-sheet DCXO1
DCXO2: P1.2-16(16) ; off-sheet DCXO2
FPGA_TCK: P1.3-77(77) ; off-sheet FPGA_TCK
FPGA_TDI: P1.3-78(78) ; off-sheet FPGA_TDI
FPGA_TDO: P1.3-79(79) ; off-sheet FPGA_TDO
FPGA_TMS: P1.3-80(80) ; off-sheet FPGA_TMS
GPS1_RST: P1.1-22(22) ; off-sheet GPS1_RST
GPS1_RX: P1.2-79(79) ; off-sheet GPS1_RX
GPS1_TP1: P1.1-32(32) ; off-sheet GPS1_TP1
GPS1_TP2: P1.1-34(34) ; off-sheet GPS1_TP2
GPS1_TX: P1.2-80(80) ; off-sheet GPS1_TX
GPS2_RST: P1.1-35(35) ; off-sheet GPS2_RST
GPS2_RX: P1.3-1(1) ; off-sheet GPS2_RX
GPS2_TP1: P1.1-43(43) ; off-sheet GPS2_TP1
GPS2_TP2: P1.1-45(45) ; off-sheet GPS2_TP2
GPS2_TX: P1.3-2(2) ; off-sheet GPS2_TX
IMU_BOOT: P1.1-62(62) ; off-sheet IMU_BOOT
IMU_CLKSEL0: P1.1-64(64) ; off-sheet IMU_CLKSEL0
IMU_ENV_SCL: P1.3-31(31) ; off-sheet IMU_ENV_SCL
IMU_ENV_SDA: P1.3-37(37) ; off-sheet IMU_ENV_SDA
IMU_INT: P1.1-46(46) ; off-sheet IMU_INT
IMU_NRST: P1.1-48(48) ; off-sheet IMU_NRST
IMU_PS0: P1.1-54(54) ; off-sheet IMU_PS0
IMU_PS1: P1.1-56(56) ; off-sheet IMU_PS1
KEY1: P1.3-23(23) ; off-sheet KEY1
KEY2: P1.1-67(67) ; off-sheet KEY2
LED1: P1.1-77(77) ; off-sheet LED1
LED2: P1.1-75(75) ; off-sheet LED2
LED3: P1.1-73(73) ; off-sheet LED3
LED4: P1.1-71(71) ; off-sheet LED4
MAC_10Mout: P1.2-33(33) ; off-sheet MAC_FREQ_CTRL, off-sheet MAC_10Mout  [also labelled MAC_FREQ_CTRL]
MAC_ALARM: P1.2-35(35) ; off-sheet MAC_ALARM
MAC_BITE: P1.2-37(37) ; off-sheet MAC_BITE
MAC_PPS_IN0+: P1.2-45(45) ; off-sheet MAC_PPS_IN0+, off-sheet MAC_PPSin  [also labelled MAC_PPSin]
MAC_PPS_IN0-: P1.2-47(47) ; off-sheet MAC_PPS_IN0-
MAC_PPS_IN1+: P1.2-51(51) ; off-sheet MAC_PPS_IN1+
MAC_PPS_IN1-: P1.2-53(53) ; off-sheet MAC_PPS_IN1-
MAC_PPS_OUT+: P1.2-41(41) ; off-sheet MAC_PPS_OUT+, off-sheet MAC_PPSout  [also labelled MAC_PPSout]
MAC_PPS_OUT-: P1.2-43(43) ; off-sheet MAC_PPS_OUT-
MAC_RF_OUT: P1.2-11(11) P1.2-13(13) ; off-sheet MAC_RF_OUT
MAC_RX: P1.2-28(28) ; off-sheet MAC_RX
MAC_TX: P1.2-26(26) ; off-sheet MAC_TX
MAC_USB+: P1.2-72(72) ; off-sheet MAC_USB+
MAC_USB-: P1.2-74(74) ; off-sheet MAC_USB-
MAC_USB_PWR: P1.2-8(8) ; off-sheet MAC_USB_PWR
MISO: P1.1-23(23) ; off-sheet MISO
MOSI: P1.1-21(21) ; off-sheet MOSI
OE_5356: P1.2-6(6) ; off-sheet OE_5356
PCIE_CLK_N: P1.4-38(38) ; off-sheet PCIE_CLK_N
PCIE_CLK_P: P1.4-36(36) ; off-sheet PCIE_CLK_P
PCIE_PERST: P1.3-21(21) ; off-sheet PCIE_PERST
PCIE_RX0_N: P1.4-37(37) ; off-sheet PCIE_RX0_N
PCIE_RX0_P: P1.4-35(35) ; off-sheet PCIE_RX0_P
PCIE_RX1_N: P1.4-32(32) ; off-sheet PCIE_RX1_N
PCIE_RX1_P: P1.4-30(30) ; off-sheet PCIE_RX1_P
PCIE_RX2_N: P1.4-20(20) ; off-sheet PCIE_RX2_N
PCIE_RX2_P: P1.4-18(18) ; off-sheet PCIE_RX2_P
PCIE_RX3_N: P1.4-25(25) ; off-sheet PCIE_RX3_N
PCIE_RX3_P: P1.4-23(23) ; off-sheet PCIE_RX3_P
PCIE_TX0_N: P1.4-31(31) ; off-sheet PCIE_TX0_N
PCIE_TX0_P: P1.4-29(29) ; off-sheet PCIE_TX0_P
PCIE_TX1_N: P1.4-26(26) ; off-sheet PCIE_TX1_N
PCIE_TX1_P: P1.4-24(24) ; off-sheet PCIE_TX1_P
PCIE_TX2_N: P1.4-14(14) ; off-sheet PCIE_TX2_N
PCIE_TX2_P: P1.4-12(12) ; off-sheet PCIE_TX2_P
PCIE_TX3_N: P1.4-19(19) ; off-sheet PCIE_TX3_N
PCIE_TX3_P: P1.4-17(17) ; off-sheet PCIE_TX3_P
RTC_MFP: P1.3-51(51) ; off-sheet RTC_MFP
SCK: P1.1-25(25) ; off-sheet SCK
SCL: P1.2-67(67) ; off-sheet SCL
SDA: P1.2-61(61) ; off-sheet SDA
UART1_RXD: P1.2-77(77) ; off-sheet UART1_RXD
UART1_TXD: P1.2-71(71) ; off-sheet UART1_TXD

Not connected (* = marked no-connect by the designer): P1 1-11(11)* 1-12(12)* 1-13(13)* 1-14(14)* 1-15(15)* 1-16(16) 1-17(17)* 1-18(18) 1-24(24) 1-26(26) 1-28(28) 1-31(31) 1-33(33) 1-36(36) 1-37(37) 1-38(38) 1-41(41) 1-42(42) 1-44(44) 1-47(47) 1-51(51) 1-52(52)* 1-53(53) 1-55(55)* 1-57(57)* 1-58(58) 1-61(61) 1-63(63) 1-65(65) 1-66(66)* 1-68(68)* 1-72(72)* 1-74(74)* 1-76(76)* 1-78(78)* 1-79(79)* 1-80(80)* 2-1(1) 2-2(2) 2-3(3) 2-4(4) 2-5(5) 2-7(7) 2-12(12) 2-14(14) 2-15(15) 2-17(17) 2-18(18) 2-22(22) 2-24(24) 2-31(31) 2-32(32) 2-36(36) 2-38(38) 2-42(42) 2-44(44) 2-46(46) 2-48(48) 2-52(52) 2-54(54) 2-55(55) 2-56(56) 2-57(57) 2-58(58) 2-62(62) 2-63(63) 2-65(65) 2-66(66) 2-68(68) 2-73(73) 2-75(75) 2-76(76) 2-78(78) 3-3(3) 3-4(4) 3-5(5) 3-6(6) 3-7(7) 3-8(8) 3-11(11) 3-12(12) 3-13(13) 3-14(14) 3-15(15) 3-16(16) 3-17(17) 3-18(18) 3-22(22) 3-24(24) 3-25(25) 3-26(26) 3-27(27) 3-28(28) 3-32(32) 3-33(33) 3-34(34) 3-35(35) 3-36(36) 3-38(38) 3-41(41) 3-42(42) 3-43(43) 3-44(44) 3-45(45) 3-46(46) 3-47(47) 3-48(48) 3-52(52) 3-53(53) 3-54(54) 3-55(55) 3-56(56) 3-57(57) 3-58(58) 3-61(61) 3-62(62) 3-63(63) 3-64(64) 3-65(65) 3-66(66) 3-67(67) 3-68(68) 3-71(71) 3-72(72) 3-73(73) 3-74(74) 3-75(75)* 3-76(76)* 4-1(1)* 4-2(2)* 4-3(3)* 4-4(4)* 4-5(5)* 4-6(6)* 4-7(7)* 4-8(8)* 4-11(11)* 4-13(13)* 4-16(16) 4-22(22) 4-28(28) 4-34(34) 4-41(41) 4-42(42) 4-43(43) 4-44(44) 4-45(45) 4-46(46) 4-47(47) 4-48(48) 4-51(51) 4-52(52) 4-53(53) 4-54(54) 4-55(55) 4-56(56) 4-57(57) 4-58(58) 4-61(61) 4-62(62) 4-63(63) 4-64(64) 4-65(65) 4-66(66) 4-67(67) 4-68(68) 4-71(71) 4-72(72) 4-73(73) 4-74(74) 4-75(75) 4-76(76) 4-77(77) 4-78(78) 4-79(79)* 4-80(80)* 81* 82* 83* 84*

### Layout directives
differential pair: PCIE_CLK_N, PCIE_CLK_P, PCIE_RX0_N, PCIE_RX0_P, PCIE_RX1_N, PCIE_RX1_P, PCIE_RX2_N, PCIE_RX2_P, PCIE_RX3_N, PCIE_RX3_P, PCIE_TX0_N, PCIE_TX0_P, PCIE_TX1_N, PCIE_TX1_P, PCIE_TX2_N, PCIE_TX2_P, PCIE_TX3_N, PCIE_TX3_P

### Library data of the parts
P1 = ALINX_FPGA: MFG PART NUM: AXK680337YG; VALENTIUM PART NUM: <VALENTIUM>; MFG Name: Panasonic; MAXTEMP: C; P1: VERT; P2: .05; P3: ALIGN, LOCK; DESC: CONN, HDR, 2X40, VERT, .05, ALIGN, SMT, TFM-1XX; MODIFY DATE: 10/10/2013; CATEGORY: MOD, FPGA; MINTEMP: C; SIZE: SMT

## Nets that join several sheets
+3.3V: Power Supplies (9 pins), GPS-IMU (10 pins)
+5.0V: Power Supplies (8 pins), GPS-IMU (10 pins), FPGA (8 pins)
GND: Power Supplies (30 pins), GPS-IMU (24 pins), FPGA (56 pins)
CSN: GPS-IMU (U8.18), FPGA (P1.1-27)
GPS1_RST: GPS-IMU (U9.4), FPGA (P1.1-22)
GPS1_RX: GPS-IMU (JP2.1 U9.5), FPGA (P1.2-79)
GPS1_TP1: GPS-IMU (U9.6), FPGA (P1.1-32)
GPS1_TP2: GPS-IMU (U9.7), FPGA (P1.1-34)
GPS1_TX: GPS-IMU (JP1.1 U9.3), FPGA (P1.2-80)
GPS2_RST: GPS-IMU (U14.4), FPGA (P1.1-35)
GPS2_RX: GPS-IMU (R12.1 U14.5), FPGA (P1.3-1)
GPS2_TP1: GPS-IMU (U14.6), FPGA (P1.1-43)
GPS2_TP2: GPS-IMU (U14.7), FPGA (P1.1-45)
GPS2_TX: GPS-IMU (R10.1 U14.3), FPGA (P1.3-2)
IMU_BOOT: GPS-IMU (U8.4), FPGA (P1.1-62)
IMU_CLKSEL0: GPS-IMU (U8.10), FPGA (P1.1-64)
IMU_ENV_SCL: GPS-IMU (U8.15), FPGA (P1.3-31)
IMU_ENV_SDA: GPS-IMU (U8.16), FPGA (P1.3-37)
IMU_INT: GPS-IMU (U8.14), FPGA (P1.1-46)
IMU_NRST: GPS-IMU (U8.11), FPGA (P1.1-48)
IMU_PS0: GPS-IMU (U8.6), FPGA (P1.1-54)
IMU_PS1: GPS-IMU (U8.5), FPGA (P1.1-56)
MAC_RX: GPS-IMU (R13.1), FPGA (P1.2-28)
MAC_TX: GPS-IMU (R11.1), FPGA (P1.2-26)
MISO: GPS-IMU (U8.20), FPGA (P1.1-23)
MOSI: GPS-IMU (U8.17), FPGA (P1.1-21)
SCK: GPS-IMU (U8.19), FPGA (P1.1-25)
SCL: GPS-IMU (IC?.2), FPGA (P1.2-67)
SDA: GPS-IMU (IC?.4), FPGA (P1.2-61)